# EAGLE design battery-addonnboard (EAGLE 6.2)
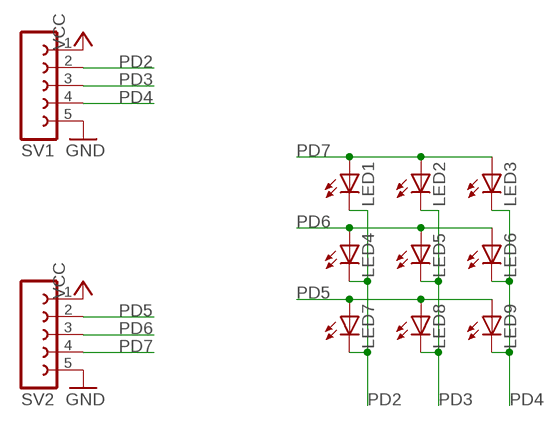
[diagram p0: schematic, sheet 1]

## Parts
LED1  LED5MM  [LED5MM]
LED2  LED5MM  [LED5MM]
LED3  LED5MM  [LED5MM]
LED4  LED5MM  [LED5MM]
LED5  LED5MM  [LED5MM]
LED6  LED5MM  [LED5MM]
LED7  LED5MM  [LED5MM]
LED8  LED5MM  [LED5MM]
LED9  LED5MM  [LED5MM]
SV1  FE05-1  [FE05-1]
SV2  FE05-1  [FE05-1]

## Nets
GND: SV1.5 SV2.5
PD2: LED1.K(C) LED4.K(C) LED7.K(C) SV1.2
PD3: LED2.K(C) LED5.K(C) LED8.K(C) SV1.3
PD4: LED3.K(C) LED6.K(C) LED9.K(C) SV1.4
PD5: LED7.A LED8.A LED9.A SV2.2
PD6: LED4.A LED5.A LED6.A SV2.3
PD7: LED1.A LED2.A LED3.A SV2.4
VCC: SV1.1 SV2.1

## Library data of the parts
LED1-LED9 = led:LED: LED OSRAM: - CHIPLED LG R971, LG N971, LY N971, LG Q971, LY Q971, LO R971, LY R971 LH N974, LH R974 LS Q976, LO Q976, LY Q976 LO Q996 - Hyper CHIPLED LW Q18S LB Q993, LB Q99A, LB R99A - SideLED LS A670, LO A670, LY A670, LG A670, LP A670 LB A673, LV A673, LT A673, LW A673 LH A674 LY A675 LS A676, LA A676, LO A676, LY A676, LW A676 LS A679, LY A679, LG A679 - Hyper Micro SIDELED® LS Y876, LA Y876, LO Y876, LY Y876 LT Y87S - SmartLED LW L88C, LW L88S LB L89C, LB L89S, LG L890 LS L89K, LO L89K, LY L89K LS L896, LA L896, LO L896, LY L896 - TOPLED LS T670, LO T670, LY T670, LG T670, LP T670 LSG T670, LSP T670, LSY T670, LOP T670, LYG T670 LG T671, LOG T671, LSG T671 LB T673, LV T673, LT T673, LW T673 LH T674 LS T676, LA T676, LO T676, LY T676, LB T676, LH T676, LSB T676, LW T676 LB T67C, LV T67C, LT T67C, LS T67K, LO T67K, LY T67K, LW E67C LS E67B, LA E67B, LO E67B, LY E67B, LB E67C, LV E67C, LT E67C LW T67C LS T679, LY T679, LG T679 LS T770, LO T770, LY T770, LG T770, LP T770 LB T773, LV T773, LT T773, LW T773 LH T774 LS E675, LA E675, LY E675, LS T675 LS T776, LA T776, LO T776, LY T776, LB T776 LHGB T686 LT T68C, LB T68C - Hyper Mini TOPLED® LB M676 - Mini TOPLED Santana® LG M470 LS M47K, LO M47K, LY M47K Source: http://www.osram.convergy.de LUXEON: - LUMILED® LXK2-PW12-R00, LXK2-PW12-S00, LXK2-PW14-U00, LXK2-PW14-V00 LXK2-PM12-R00, LXK2-PM12-S00, LXK2-PM14-U00 LXK2-PE12-Q00, LXK2-PE12-R00, LXK2-PE12-S00, LXK2-PE14-T00, LXK2-PE14-U00 LXK2-PB12-K00, LXK2-PB12-L00, LXK2-PB12-M00, LXK2-PB14-N00, LXK2-PB14-P00, LXK2-PB14-Q00 LXK2-PR12-L00, LXK2-PR12-M00, LXK2-PR14-Q00, LXK2-PR14-R00 LXK2-PD12-Q00, LXK2-PD12-R00, LXK2-PD12-S00 LXK2-PH12-R00, LXK2-PH12-S00 LXK2-PL12-P00, LXK2-PL12-Q00, LXK2-PL12-R00 Source: www.luxeon.com KINGBRIGHT: KA-3528ASYC Source: www.kingbright.com
SV1 SV2 = con-lsta:FE05-1: FEMALE HEADER; OC_FARNELL: unknown; OC_NEWARK: unknown

## Board
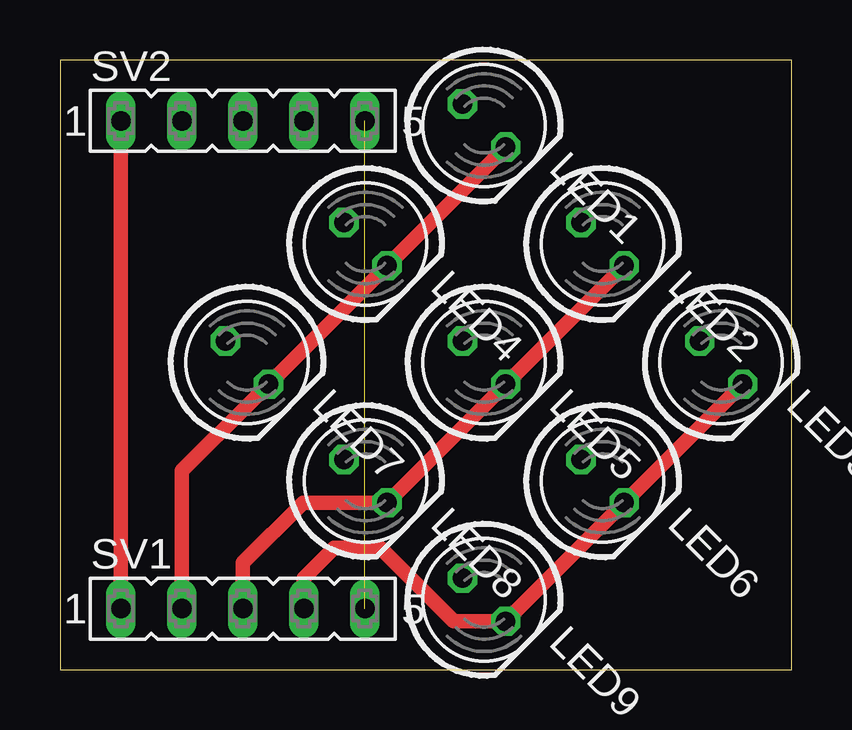
[diagram p1: board, top side]
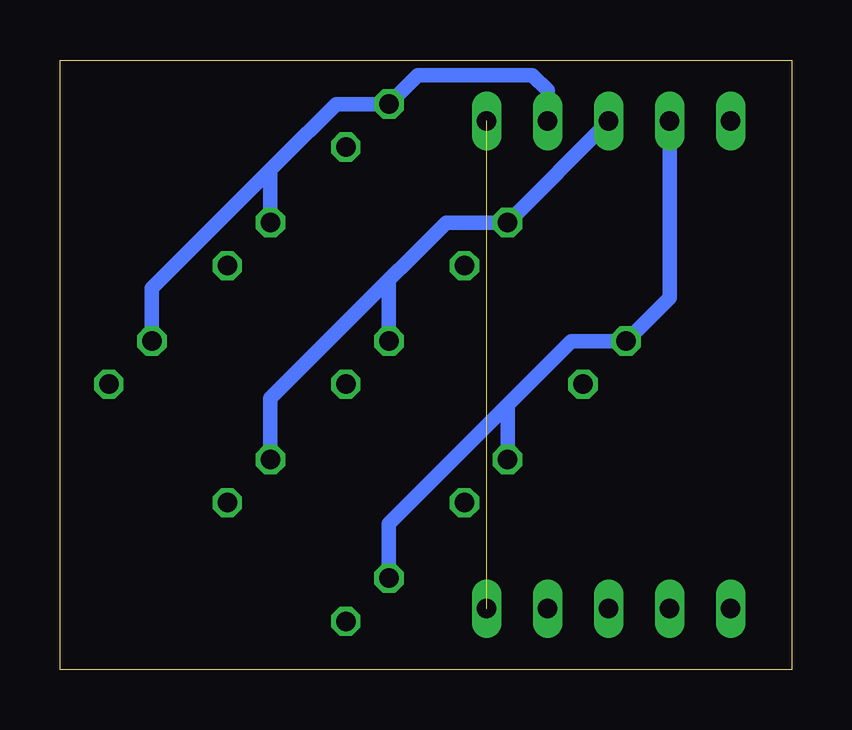
[diagram p2: board, bottom side, seen from below]

Size 30.48 x 25.4 mm. Coordinates in mm from the lower left corner, seen from the top.
Outline: 0,0 30.48,0 30.48,25.4 0,25.4 0,0
Copper layers (1*16): Top 0.0356mm / dielectric 1.5011mm / Bottom 0.0356mm
Design rules: minimum track width 6mil, minimum drill 13mil, track to track 6mil, track to pad 6mil, pad to pad 6mil, via to via 6mil, smd to smd 6mil, copper to edge 15mil, drill to drill 6mil, minimum pad ring 7mil, minimum via ring 7mil, stop-mask expansion 4mil, vias tented up to drill 0mil, thermal gap 10mil

### Footprints (pad centres in the part's own frame; a part is rotated, then mirrored left to right if it is on the bottom)
LED5MM = drill 0.813 octagon: A -1.27,0; K 1.27,0
FE05-1 = drill 0.813 long: 1 -5.08,0; 2 -2.54,0; 3 0,0; 4 2.54,0; 5 5.08,0

### Placement (x,y rotation side)
LED1  17.67,22.67 315 top
LED2  22.61,17.73 315 top
LED3  27.55,12.79 315 top
LED4  12.73,17.73 315 top
LED5  17.67,12.79 315 top
LED6  22.61,7.85 315 top
LED7  7.79,12.79 315 top
LED8  12.73,7.85 315 top
LED9  17.67,2.91 315 top
SV1  7.62,2.54 0 top
SV2  7.62,22.86 0 top

### Tracks (layer width: path | path; a pad name or v marks a point on that pad's centre or on a via)
GND  (1 unrouted)
PD2
  Top 0.61: SV1.2 5.08,8.28 7.92,11.13 LED7.K | LED7.K LED1.K | LED4.K | LED4.K LED7.K | LED7.K
PD3
  Top 0.61: LED8.K | LED8.K LED5.K | LED5.K | LED5.K LED2.K | LED8.K 10.13,6.95 7.62,4.45 SV1.3
PD4
  Top 0.61: SV1.4 10.16,3.81 11.43,5.08 13.34,5.08 16.4,2.01 LED9.K LED6.K | LED6.K | LED6.K LED3.K
PD5
  Bottom 0.61: SV2.2 5.08,15.5 LED7.A 9.17,13.69 11.11,11.75 11.83,11.03 | 11.83,11.03 16.77,6.09 LED9.A | LED8.A 11.83,11.03
PD6
  Bottom 0.61: SV2.3 7.62,22.84 LED4.A 14.39,18.63 15.88,17.14 16.77,16.25 | 16.77,16.25 21.71,11.31 LED6.A | LED5.A 16.77,16.25
PD7
  Bottom 0.61: SV2.4 10.16,24.13 10.79,24.77 15.57,24.77 LED1.A 18.98,23.57 21.27,21.27 21.71,20.83 | 21.71,20.83 26.65,15.89 LED3.A | LED2.A 21.71,20.83
VCC
  Top 0.61: SV2.1 SV1.1